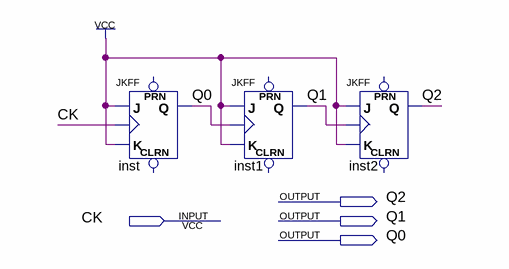
[diagram p0: schematic sheet]
// Quartus schematic 8_MOD_A_D.bdf as structural Verilog: 3 symbols, 4 pins
module \8_MOD_A_D  (
  input  CK,
  output Q2,
  output Q1,
  output Q0
);

  JKFF inst (.K(1'b1), .J(1'b1), .CLK(CK), .Q(Q0));  // open: PRN, CLRN
  JKFF inst1 (.K(1'b1), .J(1'b1), .CLK(Q0), .Q(Q1));  // open: PRN, CLRN
  JKFF inst2 (.K(1'b1), .J(1'b1), .CLK(Q1), .Q(Q2));  // open: PRN, CLRN
endmodule
